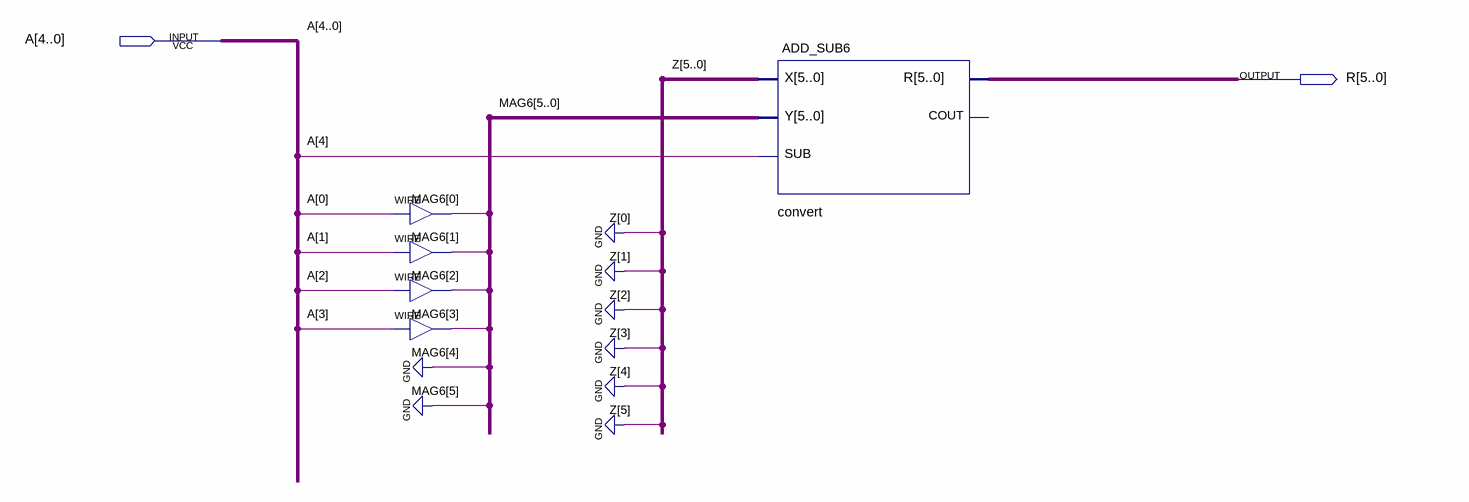
[diagram p0: schematic sheet]
// Quartus schematic SM_C2.bdf as structural Verilog: 5 symbols, 2 pins
module SM_C2 (
  input  [4:0] A,
  output [5:0] R
);

  wire [3:0] MAG6;

  assign MAG6[0] = A[0];  // WIRE map_MAG6_0
  assign MAG6[1] = A[1];  // WIRE map_MAG6_1
  assign MAG6[2] = A[2];  // WIRE map_MAG6_2
  assign MAG6[3] = A[3];  // WIRE map_MAG6_3
  ADD_SUB6 convert (.X({6{1'b0}}), .Y({2'b00, MAG6}), .SUB(A[4]), .R(R));  // open: COUT
endmodule
